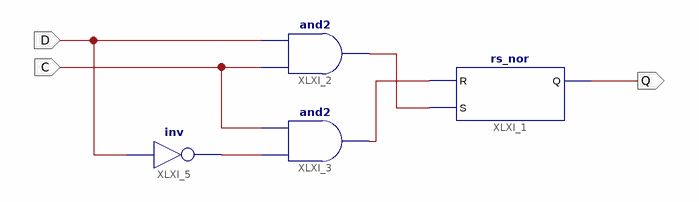
[diagram p0: schematic sheet 1]
// Xilinx ISE schematic d_trigger.sch (spartan6) as structural Verilog: 4 symbols, 3 ports
module d_trigger (
  input  D,
  input  C,
  output Q
);

  wire XLXN_3, XLXN_5, XLXN_7;

  rs_nor XLXI_1 (.R(XLXN_7), .S(XLXN_5), .Q(Q));
  and XLXI_2 (XLXN_5, C, D);
  and XLXI_3 (XLXN_7, XLXN_3, C);
  not XLXI_5 (XLXN_3, D);
endmodule
